# Altium project LM_010_IMU.PrjPcb
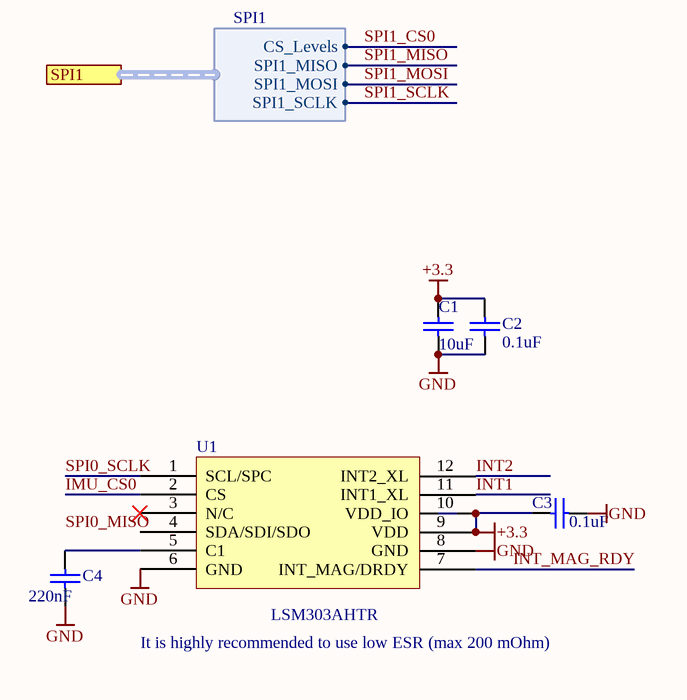
[diagram p0: IMU.SchDoc]
1 sheet, 5 parts. Net scope: flat (ports and power ports of the same name join across sheets).
Board file: IMU.PcbDoc

## Sheet IMU.SchDoc
size OrCAD A

### Parts
C1  10uF  [CAPC0402(1005)60_L]
C2  0.1uF  [CAPC0402(1005)60_L]
C3  0.1uF  [CAPC0402(1005)60_L]
C4  220nF  [CAPC0402(1005)60_L]
U1  LSM303AHTR  [LSM303AHTR]

### Ports
SPI1 (harness SPI1)

### Harnesses
SPI1: CS_Levels, SPI1_MISO, SPI1_MOSI, SPI1_SCLK

### Nets
+3.3: C1.2 C2.1 C3.1 U1.9(VDD) U1.10(VDD_IO)
GND: C1.1 C2.2 C3.2 C4.1 U1.6(GND) U1.8(GND)
IMU_CS0: U1.2(CS)
INT1: U1.11(INT1_XL)
INT2: U1.12(INT2_XL)
INT_MAG_RDY: U1.7(INT_MAG/DRDY)
SPI0_SCLK: U1.1(SCL/SPC)
SPI1_CS0: port SPI1.CS_Levels
SPI1_MISO: port SPI1.SPI1_MISO
SPI1_MOSI: port SPI1.SPI1_MOSI
SPI1_SCLK: port SPI1.SPI1_SCLK
NetC4_2: C4.2 U1.5(C1)

Not connected (* = marked no-connect by the designer): U1 3(N/C)* 4(SDA/SDI/SDO)

### Notes on the sheet
- It is highly recommended to use low ESR (max 200 mOhm)
- Labels drawn without touching a wire or pin: SPI0_MISO
- Title
- Size:
- Date:
- Orcad A
- Number:
- Time:
- Revision:
- Sheet
- of
- ZLS Corporation
- 7801 North Lamar Blvd.
- Suite E-184
- Austin, Texas 78752  USA
- (512) 453-0288
- File:

### Library data of the parts
C1-C4 = CMP-1034-00252-1: CAP CER 0.1UF 10V X7R 0402; Manufacturer: Murata Electronics North America; Manufacturer Part Number: GRM155R71A104KA01D; Tolerance: ±10%; Supplier 1: Digi-Key; Supplier Part Number 1: 490-6321-1-ND; RoHS: RoHS Compliant; Category: Capacitors; Stock 1: 2920395; Pricing 1: 1=0.1, 10=0.014, 100=0.0063, 500=0.00446, 1000=0.00351, 2500=0.00319, 5000=0.00293 (USD); Packaging: Cut Tape (CT); Part Status: Active; Voltage - Rated: 10V; Temperature Coefficient: X7R; Operating Temperature: -55°C ~ 125°C; Features: -; Ratings: -; Applications: General Purpose; Mounting Type: Surface Mount, MLCC; Package / Case: 0402 (1005 Metric); Size / Dimension: 0.039" L x 0.020" W (1.00mm x 0.50mm); Height - Seated (Max): -; Thickness (Max): 0.022" (0.55mm); Lead Spacing: -; ComponentLink1URL: http://www.murata.com/~/media/webrenewal/support/library/catalog/products/capacitor/mlcc/c02e.ashx?la=en-us; ComponentLink1Description: http://www.murata.com/~/media/webrenewal/support/library/catalog/products/capacitor/mlcc/c02e.ashx?la=en-us
U1 = LSM303AHTR: Manufacturer: STMicroelectronics; Description: ULTRA-COMPACT HIGH-PERFORMANCE E; Sensor Type: Accelerometer, Magnetometer, Temperature, 3 Axis; Output Type: I²C, SPI; Supplier 1: Digi-Key; Supplier Part Number 1: 497-17053-1-ND; Manufacturer Part Number: LSM303AHTR; RoHS: RoHS Compliant; Category: Sensors, Transducers; Stock 1: 7343; Pricing 1: 1=3, 10=2.697, 100=2.2094, 500=1.88078 (USD); Part Status: Active; Operating Temperature: -40°C ~ 85°C (TA); ComponentLink1URL: http://www.st.com/content/ccc/resource/technical/document/datasheet/1b/a1/fd/09/9f/41/44/cf/DM00177690.pdf/files/DM00177690.pdf/jcr:content/translations/en.DM00177690.pdf; ComponentLink1Description: http://www.st.com/content/ccc/resource/technical/document/datasheet/1b/a1/fd/09/9f/41/44/cf/DM00177690.pdf/files/DM00177690.pdf/jcr:content/translations/en.DM00177690.pdf